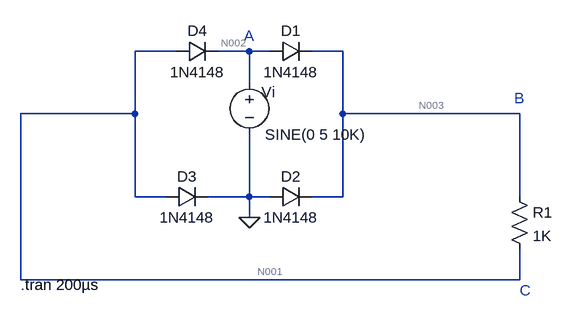
[diagram p0: schematic 1.2.1.asc]
1.2.1.asc, the LTspice schematic file:
Version 4
SHEET 1 880 680
WIRE 80 96 16 96
WIRE 192 96 144 96
WIRE 224 96 192 96
WIRE 336 96 288 96
WIRE 192 144 192 96
WIRE 16 192 16 96
WIRE 16 192 -160 192
WIRE 336 192 336 96
WIRE 608 192 336 192
WIRE 16 320 16 192
WIRE 64 320 16 320
WIRE 192 320 192 224
WIRE 192 320 128 320
WIRE 224 320 192 320
WIRE 336 320 336 192
WIRE 336 320 288 320
WIRE 608 320 608 192
WIRE 192 352 192 320
WIRE -160 448 -160 192
WIRE 608 448 608 400
WIRE 608 448 -160 448
FLAG 192 352 0
SYMBOL voltage 192 128 R0
WINDOW 123 0 0 Left 0
WINDOW 39 0 0 Left 0
WINDOW 0 19 31 Left 2
SYMATTR InstName Vi
SYMATTR Value SINE(0 5 10K)
SYMBOL diode 224 112 R270
WINDOW 0 32 32 VTop 2
WINDOW 3 0 32 VBottom 2
SYMATTR InstName D1
SYMATTR Value 1N4148
SYMBOL diode 224 336 R270
WINDOW 0 32 32 VTop 2
WINDOW 3 0 32 VBottom 2
SYMATTR InstName D2
SYMATTR Value 1N4148
SYMBOL diode 64 336 R270
WINDOW 0 32 32 VTop 2
WINDOW 3 0 32 VBottom 2
SYMATTR InstName D3
SYMATTR Value 1N4148
SYMBOL diode 80 112 R270
WINDOW 0 32 32 VTop 2
WINDOW 3 0 32 VBottom 2
SYMATTR InstName D4
SYMATTR Value 1N4148
SYMBOL res 592 304 R0
SYMATTR InstName R1
SYMATTR Value 1K
TEXT -160 456 Left 2 !.tran 200µs
TEXT 184 72 Left 2 ;A
TEXT 600 168 Left 2 ;B
TEXT 608 464 Left 2 ;C

The netlist it stands for:
* 1.2.1.asc
Vi N002 0 SINE(0 5 10K)
D1 N002 N003 1N4148
D2 0 N003 1N4148
D3 N001 0 1N4148
D4 N001 N002 1N4148
R1 N003 N001 1K
.model D D
.lib standard.dio
.tran 200µs
* A
* B
* C
.backanno
.end

* Results of the author's LTspice run, read from the files saved beside the schematic
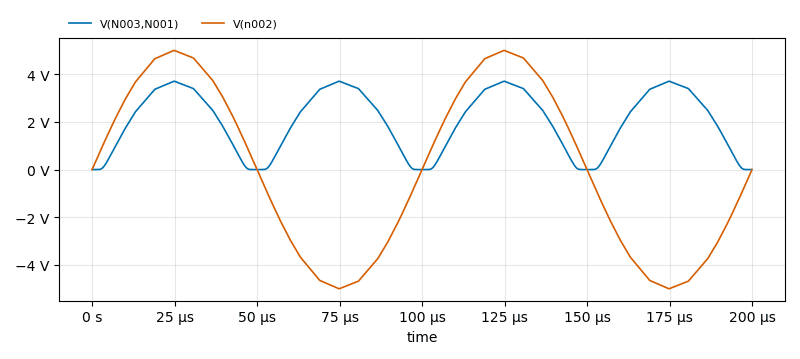
[diagram p1: Transient Analysis of 1.2.1.asc, plotted from the saved traces]
* Transient Analysis, 1 run:
*   V(N003,N001): min -30.03 µV, max 3.708 V, average 2.025 V, rms 2.422 V, last -2.872 µV
*   V(n002): min -5 V, max 5 V, average 0 V, rms 3.511 V, last 0 V